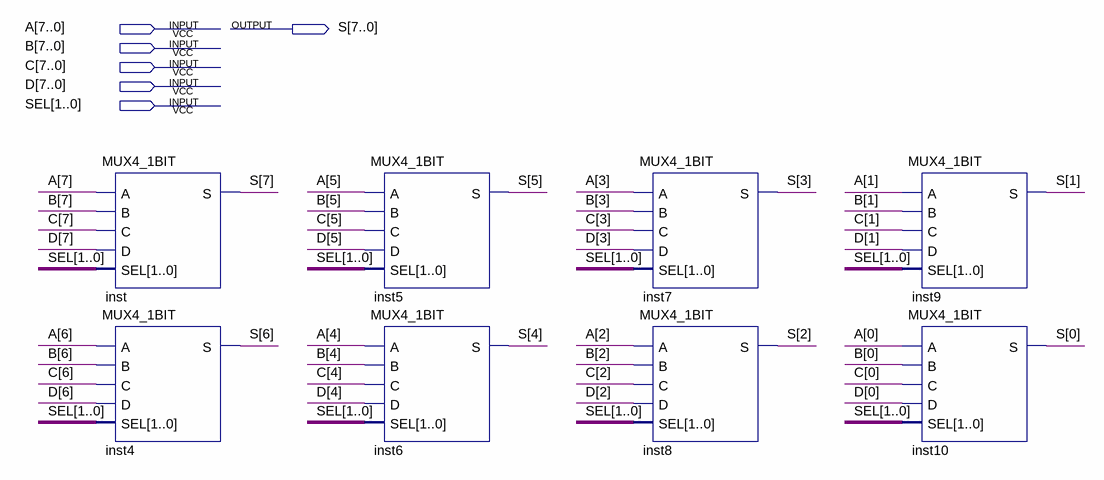
[diagram p0: schematic sheet]
// Quartus schematic MUX4_8BIT.bdf as structural Verilog: 8 symbols, 6 pins
module MUX4_8BIT (
  input  [7:0] A,
  input  [7:0] B,
  input  [7:0] C,
  input  [7:0] D,
  input  [1:0] SEL,
  output [7:0] S
);

  MUX4_1BIT inst (.A(A[7]), .B(B[7]), .C(C[7]), .D(D[7]), .SEL(SEL), .S(S[7]));
  MUX4_1BIT inst4 (.A(A[6]), .B(B[6]), .C(C[6]), .D(D[6]), .SEL(SEL), .S(S[6]));
  MUX4_1BIT inst5 (.A(A[5]), .B(B[5]), .C(C[5]), .D(D[5]), .SEL(SEL), .S(S[5]));
  MUX4_1BIT inst6 (.A(A[4]), .B(B[4]), .C(C[4]), .D(D[4]), .SEL(SEL), .S(S[4]));
  MUX4_1BIT inst7 (.A(A[3]), .B(B[3]), .C(C[3]), .D(D[3]), .SEL(SEL), .S(S[3]));
  MUX4_1BIT inst8 (.A(A[2]), .B(B[2]), .C(C[2]), .D(D[2]), .SEL(SEL), .S(S[2]));
  MUX4_1BIT inst9 (.A(A[1]), .B(B[1]), .C(C[1]), .D(D[1]), .SEL(SEL), .S(S[1]));
  MUX4_1BIT inst10 (.A(A[0]), .B(B[0]), .C(C[0]), .D(D[0]), .SEL(SEL), .S(S[0]));
endmodule
